# EasyEDA Pro project C题视觉追踪板子1.eprj, board PCB1
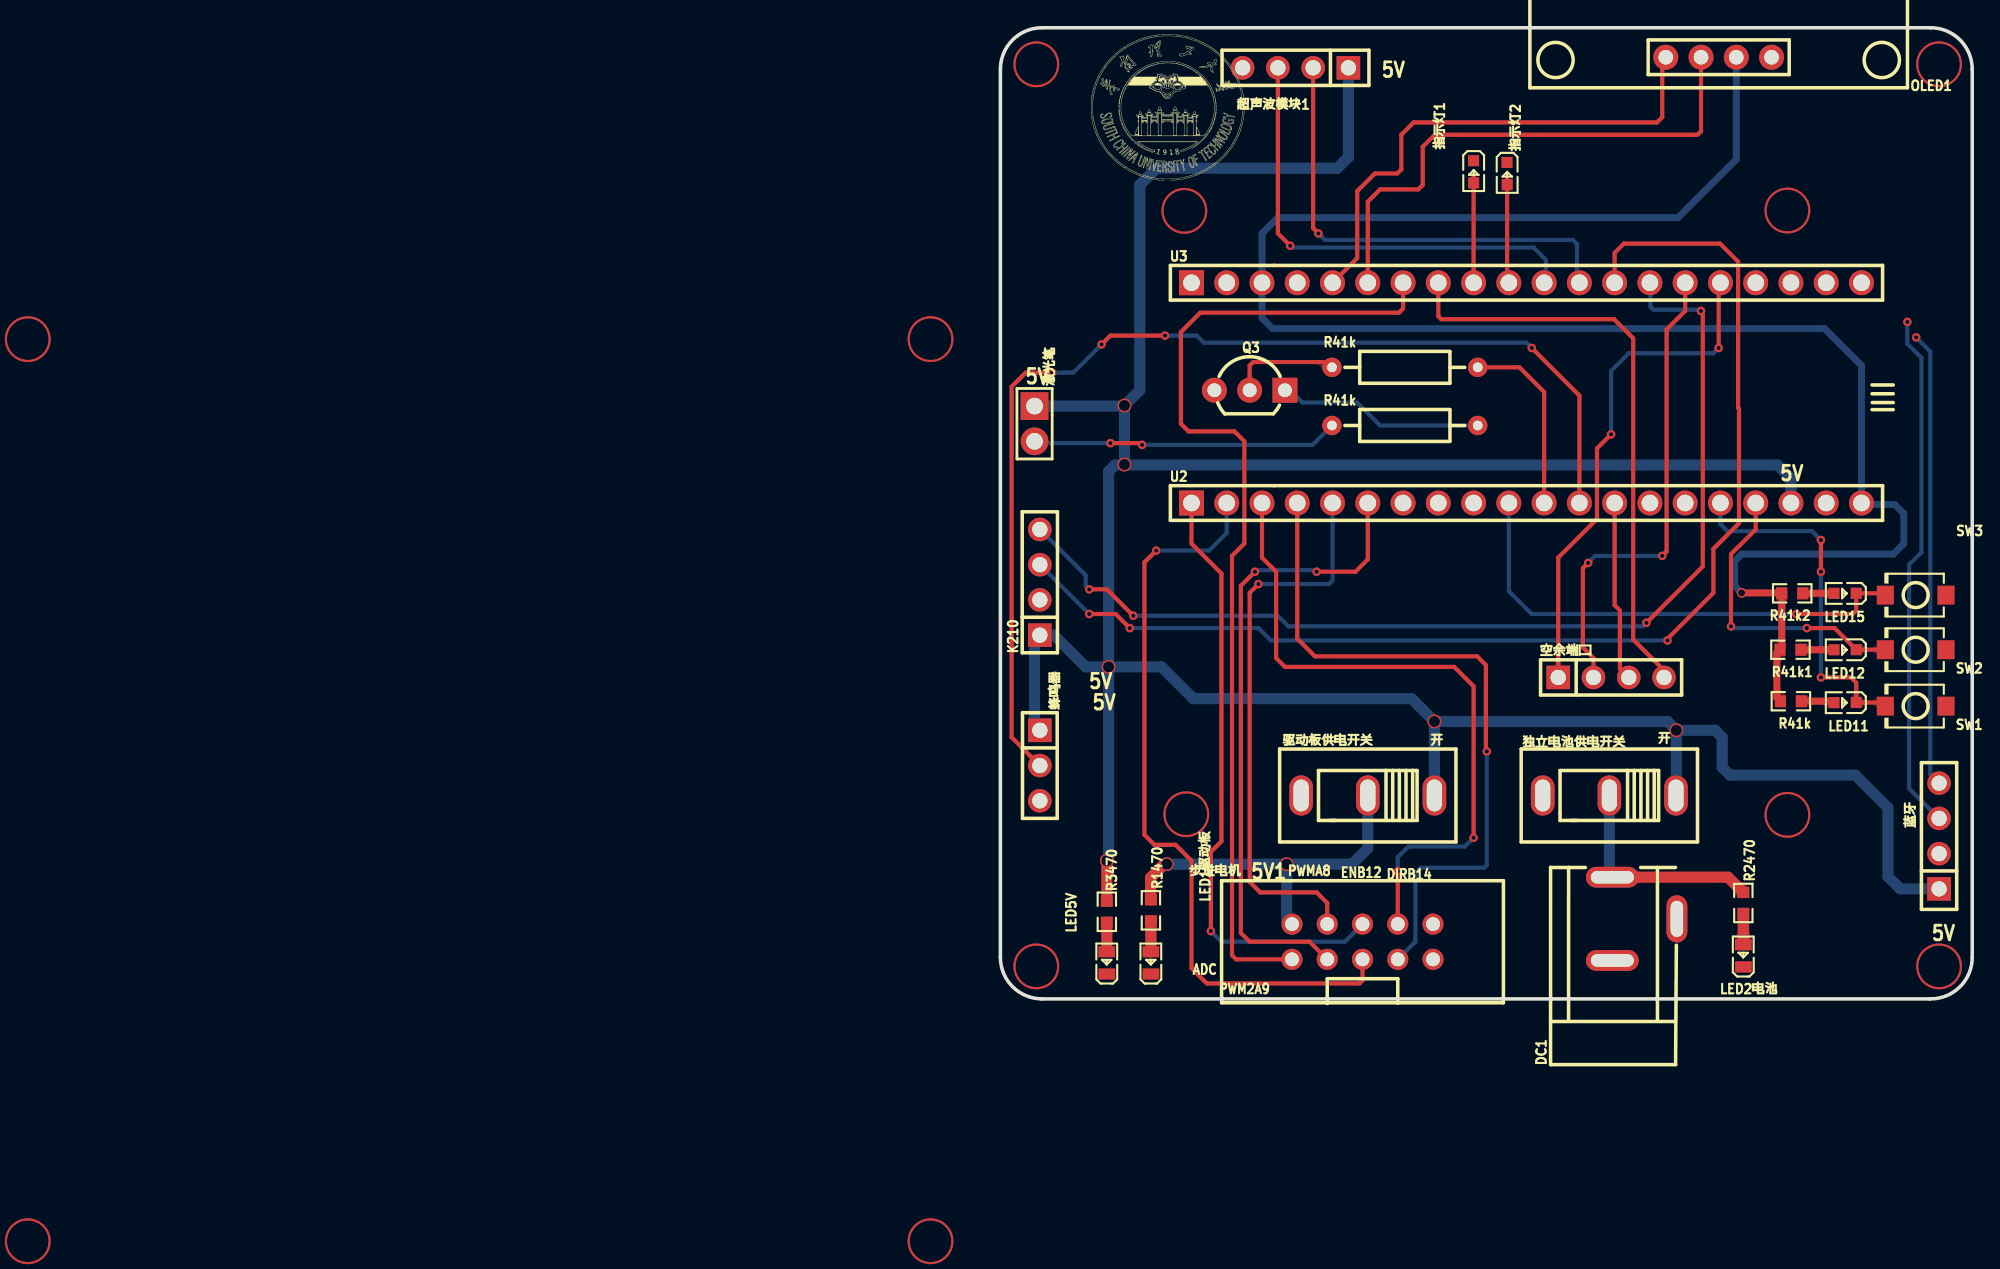
[diagram p2: board, top side]
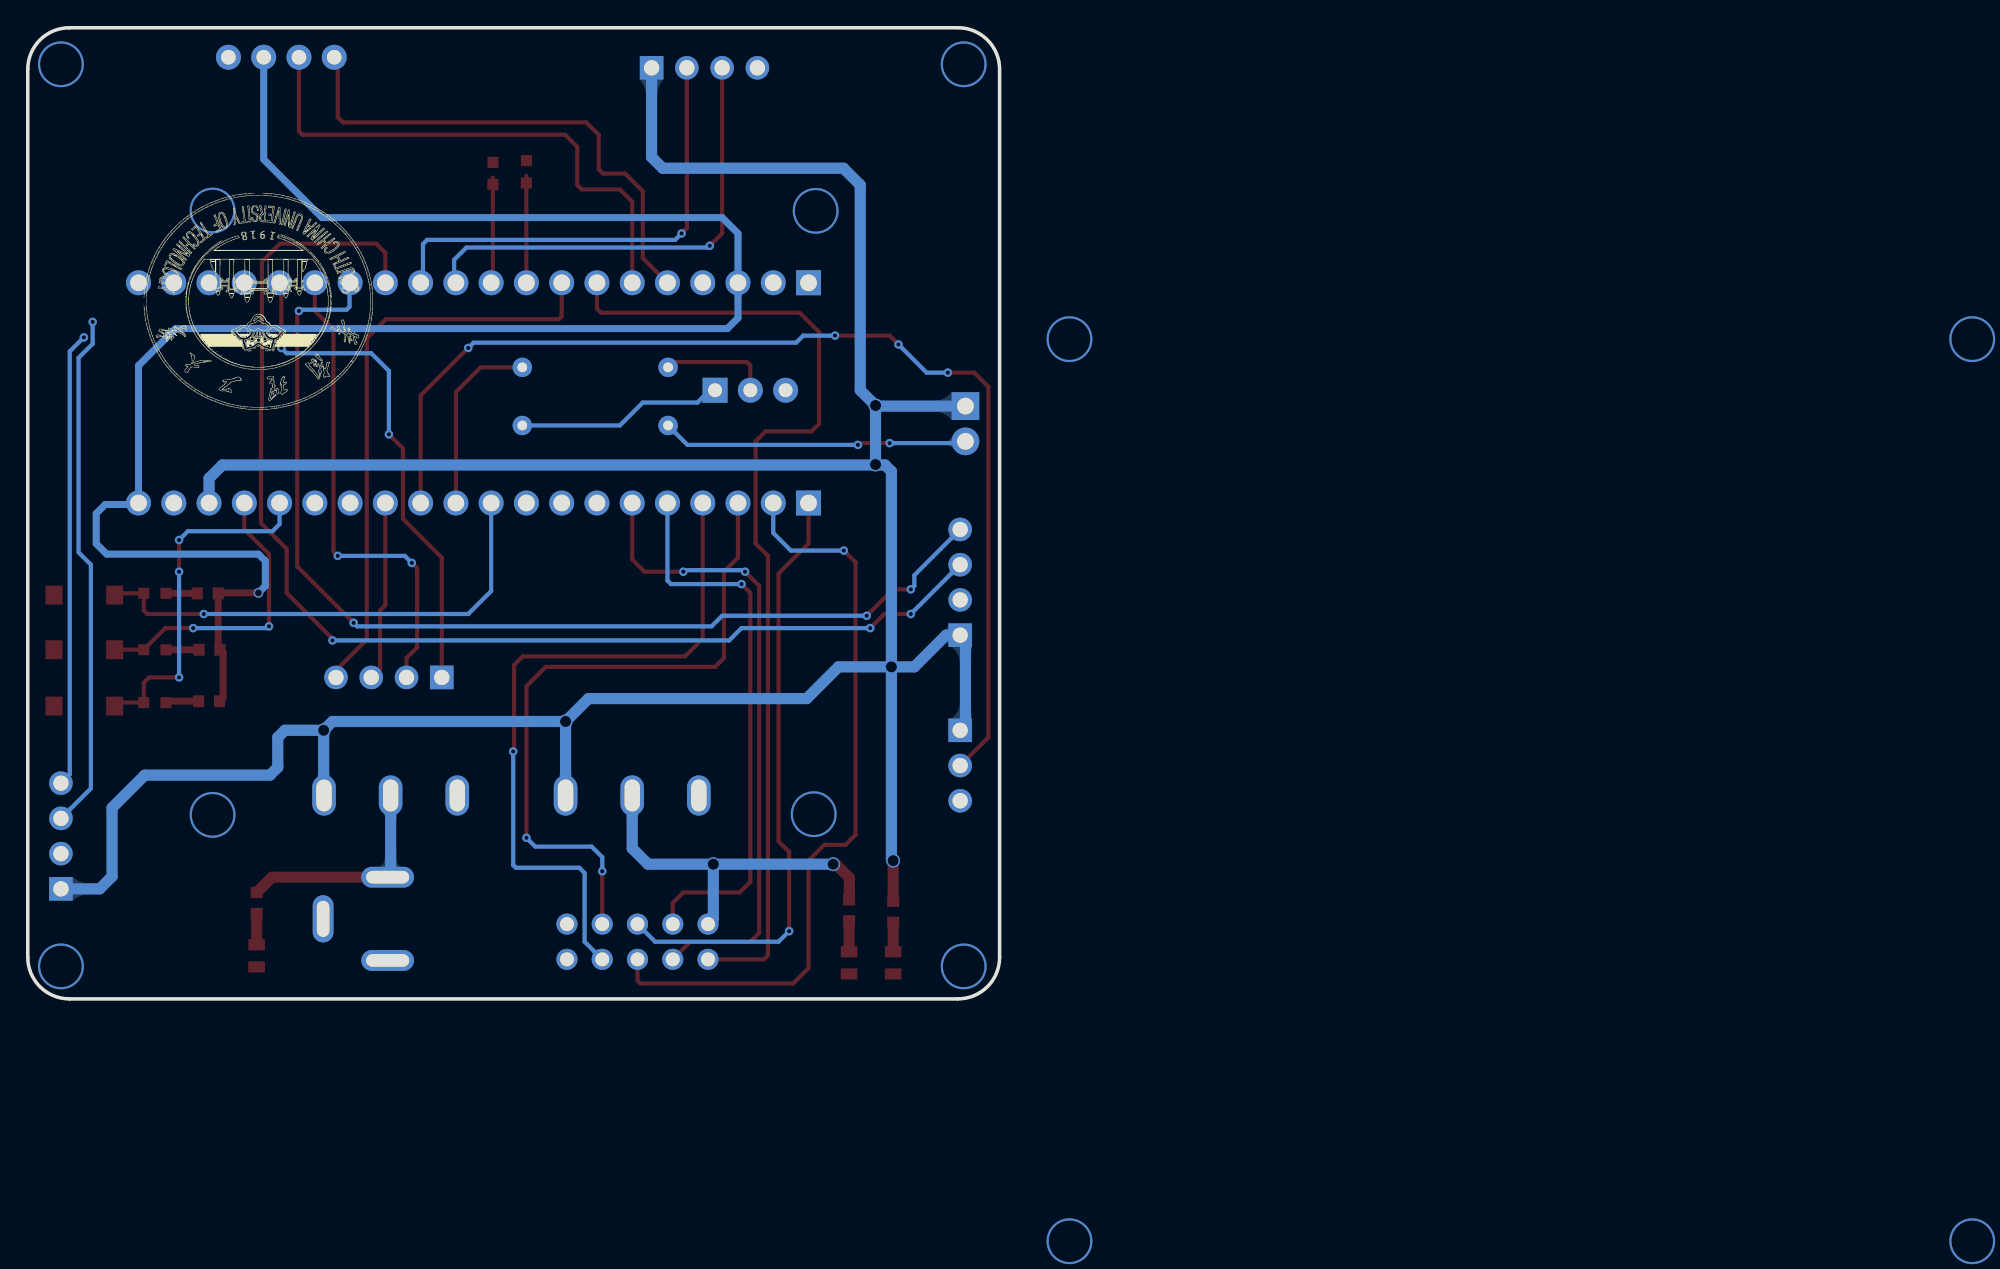
[diagram p3: board, bottom side, seen from below]

Outline 70 x 70 mm; copper layers: Top Layer, Bottom Layer. Coordinates in mm from the lower left corner of the outline.
Outline path: 0,67 0,3 arc(0.88,0.88) 3,0 67,0 arc(69.12,0.88) 70,3 70,67 arc(69.12,69.12) 67,70 3,70 arc(0.88,69.12) 0,67
Stack: Top Layer 0.035mm / Dielectric1 1.51mm FR4 er 4.5 / Bottom Layer 0.035mm

## Design rules (mm)
template: 自定义配置
spacing copperThickness1oz (default): track to track 0.102, other pairs 0.152 to 0.3
spacing copperThickness2oz: track to track 0.203, other pairs 0.152 to 0.3
track width copperThickness1oz (default): min 0.3, default 0.3, max 2.54
track width copperThickness2oz: min 0.203, default 0.254, max 2.54
differential pair differentialPair (default): width min 0.127, default 0.254, max 2.54; gap min 0.152, default 0.152
via viaSize (default): diameter min 0.5, default 0.61, max 10; hole min 0.3, default 0.305, max 6.3

## Placement (name value [footprint] x y rotation side)
DC1  DC005-T25  [DC-IN-TH_DC-005-20A-1]  46.4 5.77 90 top
K210  PZ254V-11-04P  [HDR-TH_4P-P2.54-V-M]  2.84 30.03 90 top
LED1驱动板  LTST-C191KSKT  [LED0603-RD-YELLOW]  10.84 2.6 90 top
LED2电池  LTST-C191KSKT  [LED0603-RD-YELLOW]  53.51 3.1 90 top
LED5V  LTST-C191KSKT  [LED0603-RD-YELLOW]  7.67 2.6 90 top
LED11  LTST-C191KSKT  [LED0603-RD-YELLOW#2]  60.85 21.36 180 top
LED12  LTST-C191KSKT  [LED0603-RD-YELLOW#2]  60.85 25.17 180 top
LED15  LTST-C191KSKT  [LED0603-RD-YELLOW#2]  60.85 29.23 180 top
OLED1  HS96L03W2C03  [OLED-TH_L27.8-W27.2-P2.54_C9900033791]  51.74 67.87 180 top
Q3  9013  [TO-92-3_L4.8-W3.7-P2.54-R]  17.95 43.87 0 top
R41k  1kΩ  [RES-TH_BD2.3-L6.5-P10.50-D0.5]  29.13 45.52 0 top
R41k1  1kΩ  [R0603]  56.91 25.17 180 top
R41k2  1kΩ  [R0603]  57.04 29.23 180 top
R41k#2  1kΩ  [RES-TH_BD2.3-L6.5-P10.50-D0.5]  29.13 41.33 0 top
R41k#3  1kΩ  [R0603]  56.94 21.46 180 top
R1470  470Ω  [R0603]  10.84 6.38 270 top
R2470  470Ω  [R0603]  53.51 6.91 270 top
R3470  470Ω  [R0603]  7.67 6.28 270 top
SW1  XDTD-0304-215  [SW-SMD_L3.9-W3.0-P4.45]  65.93 21.1 180 top
SW2  XDTD-0304-215  [SW-SMD_L3.9-W3.0-P4.45]  65.93 25.17 180 top
SW3  XDTD-0304-215  [SW-SMD_L3.9-W3.0-P4.45]  65.93 29.1 180 top
U2  KH-2FH-1X20P-H4.3  [hdr-th_20p-p2.54-v-f]  37.89 35.74 0 top
U3  KH-2FH-1X20P-H4.3  [hdr-th_20p-p2.54-v-f]  37.89 51.62 0 top
指示灯1  LTST-C191KSKT  [LED0603-RD-YELLOW#2]  34.08 59.62 270 top
指示灯2  LTST-C191KSKT  [LED0603-RD-YELLOW#2]  36.5 59.49 270 top
步进电机  2.54-2*5P简牛  [IDC-TH_10P-P2.54_C5665]  26.08 4.12 0 top
激光笔  PZ254V-11-02P  [HDR-TH_2P-P2.54-V-M]  2.46 41.46 270 top
独立电池供电开关  SS12D10G5  [SW-TH_SHOU-HAN_SS12D10G4]  43.86 14.66 180 top
空余端口  PZ254V-11-04P  [HDR-TH_4P-P2.54-V-M]  43.99 23.17 0 top
蓝牙  2.54-1*4P母  [HDR-TH_4P-P2.54-V-F]  67.61 11.74 90 top
蜂鸣器  PZ254V-11-03P  [HDR-TH_3P-P2.54-V-M]  2.84 16.82 270 top
超声波模块1  KH-2.54FH-1X4P-H8.5  [HDR-TH_4P-P2.54-V-F]  21.26 67.11 180 top
驱动板供电开关  SS12D10G5  [SW-TH_SHOU-HAN_SS12D10G4]  26.46 14.66 180 top

## Footprints (pads in the part's own frame, mm; a bottom-side part is the same pattern mirrored in y, then rotated)
DC-IN-TH_DC-005-20A-1
  oval 1.5x3.8 hole 0.9x3.1: 1(3,2.325) 2(-3,2.325)
  oval 3.4x1.5 hole 2.6x0.9: 3(0,-2.325)
HDR-TH_2P-P2.54-V-M
  rect 2x2 hole 1.2: 1(-1.27,0)
  round 2 hole 1.2: 2(1.27,0)
HDR-TH_3P-P2.54-V-M
  rect 1.7x1.7 hole 1.1: 1(-2.54,0)
  round 1.7 hole 1.1: 2(0,0) 3(2.54,0)
HDR-TH_4P-P2.54-V-F
  rect 1.7x1.7 hole 1.1: 1(-3.81,0)
  round 1.7 hole 1.1: 2(-1.27,0) 3(1.27,0) 4(3.81,0)
HDR-TH_4P-P2.54-V-M
  rect 1.7x1.7 hole 1.1: 1(-3.81,0)
  round 1.7 hole 1.1: 2(-1.27,0) 3(1.27,0) 4(3.81,0)
hdr-th_20p-p2.54-v-f
  rect 1.8x1.8 hole 1.2: 1(-24.13,0)
  round 1.8 hole 1.2: 2(-21.59,0) 3(-19.05,0) 4(-16.51,0) 5(-13.97,0) 6(-11.43,0) 7(-8.89,0) 8(-6.35,0) 9(-3.81,0) 10(-1.27,0) 11(1.27,0) 12(3.81,0) 13(6.35,0) 14(8.89,0) 15(11.43,0) 16(13.97,0) 17(16.51,0) 18(19.05,0) 19(21.59,0) 20(24.13,0)
IDC-TH_10P-P2.54_C5665
  round 1.524 hole 1: 1(-5.08,-1.27) 2(-5.08,1.27) 3(-2.54,-1.27) 4(-2.54,1.27) 5(0,-1.27) 6(0,1.27) 7(2.54,-1.27) 8(2.54,1.27) 9(5.08,-1.27) 10(5.08,1.27)
LED0603-RD-YELLOW
  rect 0.8x1.2 smd: 1(-0.799,-0.004) 2(0.799,0.004)
LED0603-RD-YELLOW#2
  rect 0.8x0.8 smd: 1(-0.799,-0.004) 2(0.799,0.004)
OLED-TH_L27.8-W27.2-P2.54_C9900033791
  round 1.8 hole 1.05: 1(-3.81,0) 2(-1.27,0) 3(1.27,0) 4(3.81,0)
R0603
  rect 0.806x0.864 smd: 1(-0.753,0) 2(0.753,0)
RES-TH_BD2.3-L6.5-P10.50-D0.5
  round 1.4 hole 0.7: 1(-5.25,0) 2(5.25,0)
SW-SMD_L3.9-W3.0-P4.45
  rect 1.23x1.36 smd: 1(-2.185,0) 2(2.185,0)
SW-TH_SHOU-HAN_SS12D10G4
  oval 1.7x2.9 hole 1.1x2.3: 1(-4.8,0) 2(0,0) 3(4.8,0)
TO-92-3_L4.8-W3.7-P2.54-R
  rect 1.8x1.8 hole 1: 1(2.54,0)
  round 1.8 hole 1: 2(0,0) 3(-2.54,0)

## Nets
3.3V: OLED1.2 R41k1.2 R41k2.2 R41k#3.2 U2.20 U3.3
5V: K210.1 R3470.1 U2.18 激光笔.1 独立电池供电开关.1 蓝牙.1 蜂鸣器.1 超声波模块1.1 驱动板供电开关.1
5V1: R1470.1 步进电机.2 驱动板供电开关.2
GND: DC1.2 DC1.3 K210.2 LED1驱动板.1 LED2电池.1 LED5V.1 OLED1.1 Q3.3 SW1.1 SW2.1 SW3.1 U2.19 U3.1 U3.2 指示灯1.1 指示灯2.1 步进电机.9 步进电机.10 蓝牙.2 蜂鸣器.3 超声波模块1.4
V5: DC1.1 R2470.1 独立电池供电开关.2
PA0: U3.16 空余端口.1
PA1: U3.15 空余端口.2
PA2: K210.4 U3.14
PA3: K210.3 U3.13
PA4: U3.12 超声波模块1.2
PA5: U3.11 超声波模块1.3
PA6: U3.10 指示灯2.2
PA7: U3.9 指示灯1.2
PA8: U2.5 步进电机.4
PA9: U2.6 步进电机.3
PA10: U2.7
PA11: U2.8
PA12: U2.9
PA15: LED15.1 SW3.2 U2.10
PB0: U3.8 空余端口.4
PB1: U3.7 步进电机.1
PB3: R41k.2 U2.11
PB4: U2.12 蜂鸣器.2
PB5: U2.13 空余端口.3
PB6: U2.14 蓝牙.4
PB7: U2.15 蓝牙.3
PB8: LED11.1 SW1.2 U2.16
PB9: LED12.1 SW2.2 U2.17
PB10: OLED1.3 U3.6
PB11: OLED1.4 U3.5
PB12: U2.1 步进电机.6
PB13: U2.2 步进电机.5
PB14: U2.3 步进电机.8
PB15: U2.4 步进电机.7
PC13: U3.19
PC14: U3.18
PC15: U3.17
R: U3.4
VB: U3.20
$1N953: LED2电池.2 R2470.2
$1N998: LED1驱动板.2 R1470.2
$1N1457: LED5V.2 R3470.2
$1N2717: R41k#2.1 激光笔.2
$1N2794: Q3.2 R41k.1
$1N2914: Q3.1 R41k#2.2
$1N3771: LED11.2 R41k#3.1
$1N4750: LED12.2 R41k1.1
$1N6693: LED15.2 R41k2.1

Pads without a net: 独立电池供电开关 3; 驱动板供电开关 3

## Via types
v1: diameter 3.3, hole 3, Top Layer to Bottom Layer, 12 vias
v2: diameter 1, hole 0.8, Top Layer to Bottom Layer, 8 vias
v3: diameter 0.61, hole 0.305, Top Layer to Bottom Layer, 35 vias
v4: diameter 0.7, hole 0.5, Top Layer to Bottom Layer, 1 via

## Routing (per net, layer and track width the routed paths; a pad name or vN(x,y) marks a point on that pad's centre or on a via; arc(x,y) is an arc through that point)
3.3V: length 136
  Top Layer w0.5: R41k#3.2 55.93,21.71 55.93,24.94 R41k1.2 56.28,25.29 R41k2.2 56.25,29.27 v4(53.39,29.27)
  Bottom Layer w0.5: OLED1.2 53.01,60.51 48.81,56.32 19.99,56.32 18.84,55.17 U3.3 18.84,49.08 19.6,48.32 59.36,48.32 62.02,45.65 U2.20 62.13,35.64 64.41,35.64 65.07,34.98 65.07,32.81 64.32,32.06 53.39,32.06 52.89,31.56 52.89,29.77 v4(53.39,29.27)
5V: length 225.6
  Top Layer w0.8: R3470.1 v2(7.67,9.96)
  Bottom Layer w0.8: 超声波模块1.1 25.07,60.67 24.27,59.87 11.24,59.87 10.04,58.67 10.04,43.87 v2(8.94,42.77) ; 8.97,38.48 v2(8.94,38.52) v2(8.94,42.77) ; 8.97,38.48 8.25,38.48 7.79,38.03 v2(7.79,23.93) ; 8.97,38.48 55.98,38.48 56.94,37.52 U2.18 ; v2(48.69,19.36) 48.69,14.69 独立电池供电开关.1 ; v2(48.69,19.36) 51.48,19.36 51.99,18.85 51.99,16.69 52.56,16.13 61.57,16.13 63.93,13.77 63.93,8.82 64.82,7.93 蓝牙.1 ; v2(48.69,19.36) 48.05,20 v2(31.26,20) ; v2(7.67,9.96) 7.79,10.09 v2(7.79,23.93) ; 驱动板供电开关.1 v2(31.26,20) ; v2(31.26,20) 29.61,21.65 13.89,21.65 11.6,23.93 v2(7.79,23.93) ; 2.84,19.49 2.46,19.87 2.46,25.84 K210.1 3.86,26.22 6.14,23.93 v2(7.79,23.93) ; v2(8.94,42.77) 8.89,42.73 激光笔.1
5V1: length 26.4
  Top Layer w0.8: v2(11.99,9.71) 11.79,9.71 10.82,8.73 10.82,7.16 R1470.1
  Bottom Layer w0.8: v2(20.62,9.71) 25.32,9.71 26.46,10.85 驱动板供电开关.2 ; v2(20.62,9.71) 20.62,5.77 步进电机.2 ; v2(20.62,9.71) v2(11.99,9.71)
V5: length 15.9
  Top Layer w0.8: R2470.1 52.41,8.77 DC1.1
  Bottom Layer w0.8: 独立电池供电开关.2 43.86,8.99 DC1.1
(no net):
  vias: v1(-70.06,47.55) v1(-70.06,-17.47) v1(-5.03,47.55) v1(-5.03,-17.47) v1(2.59,67.37) v1(2.59,2.34) v1(13.25,56.8) v1(13.39,13.31) v1(56.69,56.83) v1(56.69,13.26) v1(67.61,67.37) v1(67.61,2.34)
PA0: length 36.9
  Top Layer w0.3: 空余端口.1 40.18,31.81 42.97,34.6 42.97,39.68 v3(43.99,40.7) ; v3(51.74,46.92) 51.74,51.49 U3.16
  Bottom Layer w0.3: v3(51.74,46.92) 51.35,46.54 45.26,46.54 43.99,45.27 v3(43.99,40.7)
PA1: length 34.6
  Top Layer w0.3: U3.15 49.32,49.59 47.99,48.25 47.99,32.25 v3(47.67,31.93) ; 空余端口.2 42.72,24.57 41.96,25.33 41.96,31.04 v3(42.34,31.42)
  Bottom Layer w0.3: v3(42.34,31.42) 42.85,31.93 v3(47.67,31.93)
PA2: length 76.9
  Top Layer w0.3: v3(9.57,27.61) 7.67,29.52 v3(6.4,29.52) ; v3(46.53,27.11) 50.59,31.17 50.59,49.46 v3(50.47,49.59)
  Bottom Layer w0.3: v3(46.53,27.11) 46.28,26.85 20.75,26.85 19.99,27.61 v3(9.57,27.61) ; U3.14 46.82,51.58 46.82,49.88 47.04,49.67 50.38,49.67 v3(50.47,49.59) ; K210.4 6.14,30.54 6.14,29.77 v3(6.4,29.52)
PA3: length 88.8
  Top Layer w0.3: U3.13 44.24,53.78 44.91,54.44 51.83,54.44 53.13,53.14 53.13,42.6 53.2,42.53 53.2,34.29 51.35,32.44 51.35,29.27 48.05,25.96 v3(48.05,25.84) ; v3(9.32,26.73) 8.3,27.74 v3(6.4,27.74)
  Bottom Layer w0.3: v3(48.05,25.84) 19.48,25.84 18.59,26.73 v3(9.32,26.73) ; K210.3 v3(6.4,27.74)
PA4: length 33.9
  Top Layer w0.3: 超声波模块1.2 22.53,55.56 v3(22.91,55.17)
  Bottom Layer w0.3: U3.12 41.53,51.79 41.53,54.41 41.23,54.71 23.37,54.71 v3(22.91,55.17)
PA5: length 33.7
  Top Layer w0.3: 超声波模块1.3 19.99,55.17 v3(20.88,54.28)
  Bottom Layer w0.3: v3(20.88,54.28) 21,54.16 38.4,54.16 39.29,53.27 39.29,51.75 U3.11
PA6: length 7.6
  Top Layer w0.3: U3.10 36.5,51.74 指示灯2.2 36.5,59.2
PA7: length 7.7
  Top Layer w0.3: U3.9 34.09,51.62 指示灯1.2 34.09,59.33
PA8: length 40.5
  Top Layer w0.3: 步进电机.4 23.54,6.91 22.78,7.68 18.72,7.68 17.95,8.44 17.95,29.27 v3(18.59,29.9)
  Bottom Layer w0.3: U2.5 23.92,30.16 23.67,29.9 v3(18.59,29.9)
PA9: length 46.1
  Top Layer w0.3: U2.6 26.46,31.68 25.57,30.79 v3(22.78,30.79) ; v3(18.34,30.79) 17.32,29.77 17.32,4.75 17.95,4.12 22.27,4.12 步进电机.3
  Bottom Layer w0.3: v3(22.78,30.79) 22.67,30.9 18.45,30.9 v3(18.34,30.79)
PA15: length 35.5
  Top Layer w0.3: v3(57.32,27.74) 61.39,27.74 61.65,28 LED15.1 63.61,29.23 SW3.2
  Bottom Layer w0.3: U2.10 36.62,29.39 38.27,27.74 v3(57.32,27.74)
PB0: length 42.5
  Top Layer w0.3: 空余端口.4 47.8,23.68 45.58,25.9 45.58,47.61 44.2,48.99 31.75,48.99 31.54,49.2 U3.8
PB1: length 72.1
  Top Layer w0.3: 步进电机.1 16.98,2.85 16.68,3.15 16.68,31.93 17.57,32.82 17.57,40.19 16.85,40.91 13.55,40.91 13,41.46 13,48.06 14.4,49.46 28.7,49.46 29,49.76 U3.7
PB3: length 13.5
  Top Layer w0.3: R41k.2 37.38,45.52 39.16,43.74 U2.11
PB4: length 80.1
  Top Layer w0.3: v3(38.27,46.92) 41.7,43.49 U2.12 ; v3(11.86,47.81) 7.92,47.81 v3(7.29,47.17) ; v3(3.73,45.14) 1.83,45.14 0.81,44.12 0.81,18.85 蜂鸣器.2
  Bottom Layer w0.3: v3(11.86,47.81) 14.14,47.81 14.65,47.3 37.89,47.3 v3(38.27,46.92) ; v3(7.29,47.17) 5.25,45.14 v3(3.73,45.14)
PB5: length 13
  Top Layer w0.3: U2.13 44.24,28.38 44.62,28 44.62,23.81 空余端口.3
PB6: length 32.8
  Bottom Layer w0.3: v3(65.96,47.68) 66.98,46.67 66.98,16.19 蓝牙.4
PB7: length 37.5
  Bottom Layer w0.3: v3(65.32,48.8) 65.32,47.22 66.34,46.2 66.34,32.19 65.45,31.3 65.45,15.17 蓝牙.3
PB8: length 25.5
  Top Layer w0.3: v3(59.1,23.17) 61.26,23.17 61.65,22.79 LED11.1 63.48,21.36 SW1.2 ; v3(59.1,30.79) v3(59.1,33.08)
  Bottom Layer w0.3: U2.16 51.86,34.22 52.37,33.71 58.47,33.71 v3(59.1,33.08) ; v3(59.1,30.79) v3(59.1,23.17)
PB9: length 21.4
  Top Layer w0.3: U2.17 54.4,33.84 52.62,32.06 v3(52.62,26.85) ; v3(58.09,26.73) 60.09,26.73 LED12.1 63.74,25.17 SW2.2
  Bottom Layer w0.3: v3(58.09,26.73) 52.75,26.73 v3(52.62,26.85)
PB10: length 38.9
  Top Layer w0.3: OLED1.3 50.47,62.54 50.21,62.29 31.29,62.29 30.42,61.42 30.42,58.67 30.1,58.35 27.35,58.35 26.46,57.46 U3.6
PB11: length 37.4
  Top Layer w0.3: OLED1.4 47.67,67.62 47.67,63.56 47.29,63.17 29.76,63.17 28.88,62.29 28.88,59.79 28.58,59.49 26.97,59.49 25.7,58.22 25.7,53.4 U3.5
PB12: length 43.8
  Top Layer w0.3: v3(15.16,4.88) 15.16,10.6 15.92,11.36 15.92,30.66 13.76,32.82 U2.1
  Bottom Layer w0.3: 步进电机.6 24.81,4.12 15.92,4.12 v3(15.16,4.88)
PB13: length 54.9
  Top Layer w0.3: 步进电机.5 26.08,1.33 25.87,1.11 14.86,1.11 13.76,2.22 13.76,9.96 12.62,11.1 11.1,11.1 10.38,11.82 10.38,31.47 v3(11.22,32.31)
  Bottom Layer w0.3: U2.2 16.3,33.58 15.03,32.31 v3(11.22,32.31)
PB14: length 48.5
  Top Layer w0.3: v3(34.08,11.61) 34.08,22.53 32.69,23.93 20.49,23.93 19.86,24.57 19.86,30.79 18.84,31.81 U2.3 ; 步进电机.8 v3(28.62,9.2)
  Bottom Layer w0.3: v3(34.08,11.61) 33.45,10.98 29.38,10.98 28.62,10.22 v3(28.62,9.2)
PB15: length 50.7
  Top Layer w0.3: U2.4 21.38,25.96 22.65,24.69 34.34,24.69 34.97,24.06 34.97,17.9 v3(35.04,17.84)
  Bottom Layer w0.3: v3(35.04,17.84) 35.04,9.64 34.84,9.45 30.27,9.45 29.89,9.07 29.89,4.12 步进电机.7
$1N953: length 2.3
  Top Layer w0.8: LED2电池.2 53.51,3.91 R2470.2
$1N998: length 2.2
  Top Layer w0.8: R1470.2 10.84,3.4 LED1驱动板.2
$1N1457: length 2.1
  Top Layer w0.3: 7.67,3.77 7.67,3.4 LED5V.2
  Top Layer w0.8: R3470.2 7.67,3.77
$1N2717: length 22.1
  Top Layer w0.3: v3(7.92,40.06) 10.08,40.06 v3(10.21,39.93)
  Bottom Layer w0.3: v3(7.92,40.06) 2.59,40.06 激光笔.2 ; R41k#2.1 22.48,39.93 v3(10.21,39.93)
$1N2794: length 8
  Top Layer w0.3: R41k.1 23.5,45.9 18.21,45.9 17.95,45.65 Q3.2
$1N2914: length 14.9
  Bottom Layer w0.3: R41k#2.2 27.35,41.33 25.7,42.98 21.76,42.98 20.88,43.87 Q3.1
$1N3771: length 2.4
  Top Layer w0.5: LED11.2 59.94,21.46 R41k#3.1
$1N4750: length 2.4
  Top Layer w0.5: R41k1.1 60.04,25.17 LED12.2
$1N6693: length 2.3
  Top Layer w0.5: LED15.2 60.04,29.23 57.79,29.23

## Copper pours and planes (outline as drawn; the poured copper is in the pictures)
GND on Top Layer: 80.44,72.32 155.62,72.32 157.78,70.16 157.78,-1.85 157.91,-1.98 146.86,-1.98 146.22,-1.34 146.22,5.01 139.75,11.49 136.06,11.49 136.06,17.38 135.3,18.14 122.94,18.14 122.09,18.98 122.09,12.9 122.6,12.39 118.65,12.39 117.9,13.14 117.9,18.22 105.2,18.22 105.08,18.09 105.08,11.4 105.2,11.28 118.75,11.28 119.43,10.6 139.87,10.6 144.83,5.64 144.83,5.39 145.46,4.75 145.46,-1.59 84.38,-1.59 80.44,2.34
GND on Bottom Layer: -100.54,76.89 -98.12,74.48 -19.64,74.48 -19.64,8.69 -29.54,-1.21 -32.85,-1.21 -35.77,1.71 -35.77,8.82 -42.37,15.42 -46.05,15.42 -46.18,15.55 -46.18,21.9 -59.39,21.9 -59.64,22.15 -59.77,22.03 -59.77,15.55 -63.67,15.55 -64.22,16.09 -64.22,21.9 -64.09,22.03 -77.04,22.03 -77.17,22.15 -77.3,22.03 -77.3,15.68 -65.35,15.68 -64.92,15.25 -44.23,15.25 -37.8,8.82 -36.91,8.82 -36.91,3.23 -36.53,2.85 -98.5,2.85 -100.16,1.2 -100.16,60.13 -99.39,60.89 -100.54,62.03

Small or netless copper shapes (teardrops, artwork), in the pictures only: 33 on Top Layer, 45 on Bottom Layer

## Text on the board
Top Silkscreen Layer: PWM2A9 | ADC | PWMA8 | ENB12 | DIRB14 | 5V | 5V1 | 开
